# Altium schematic sheet Peripheral.SchDoc
size A4; SheetNumber: 5; SheetTotal: 5
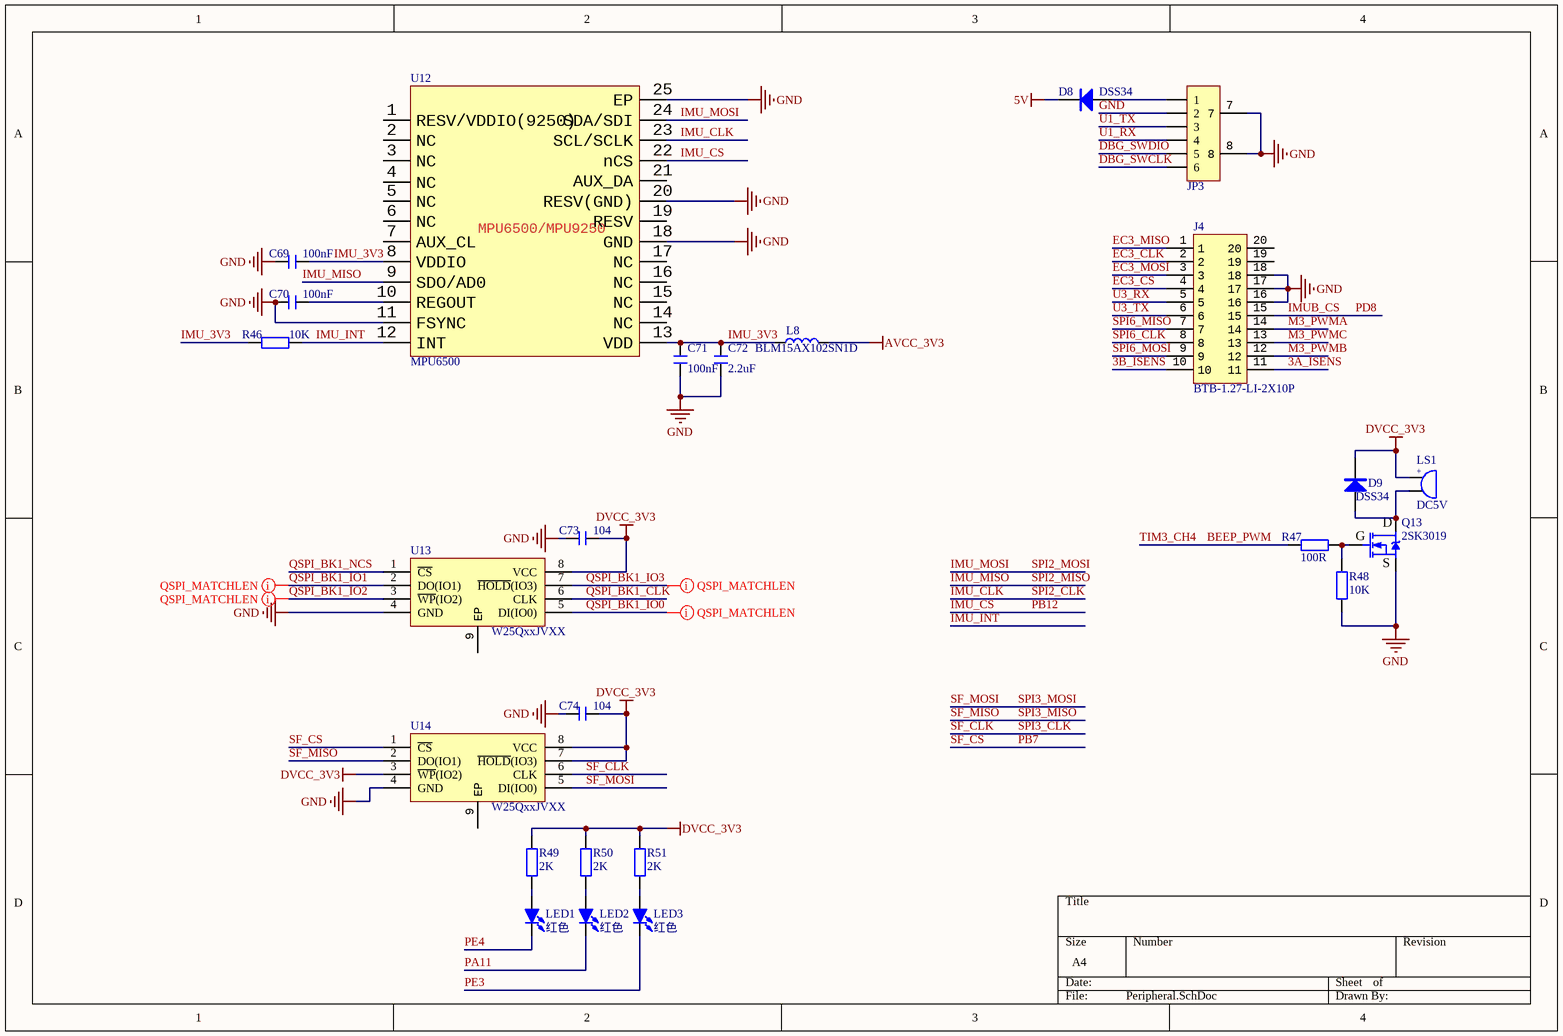
[diagram p0: Peripheral.SchDoc]

## Parts
C69  100nF  [C 0402_L]
C70  100nF  [C 0402_L]
C71  100nF  [C 0402_L]
C72  2.2uF  [C 0402_L]
C73  104  [C 0402_L]
C74  104  [C 0402_L]
D8  DSS34  [SOD-123FL]
D9  DSS34  [SOD-123FL]
J4  BTB-1.27-LI-2X10P  [1.27-LI-2X10P]
JP3  HDR-1X6  [GH1.25-WS-6P]  (value not drawn)
L8  BLM15AX102SN1D  [L 0402]
LED1  红色  [LED 0402R]
LED2  红色  [LED 0402R]
LED3  红色  [LED 0402R]
LS1  DC5V  [BEEP_SMD_SBZ9032C03R16]
Q13  2SK3019  [SOT523]
R46  10K  [R 0402_L]
R47  100R  [R 0402_L]
R48  10K  [R 0402_L]
R49  2K  [R 0402_L]
R50  2K  [R 0402_L]
R51  2K  [R 0402_L]
U12  MPU6500  [QFN24 3X3]
U13  W25QxxJVXX  [SOP8W_L]
U14  W25QxxJVXX  [SOP8W_L]

## Nets
5V: D8.1(K)
AVCC_3V3: L8.2
DVCC_3V3: C73.2 C74.2 D9.1(K) LS1.1 R49.2 R50.2 R51.2 U13.8(VCC) U14.3(~{WP}(IO2)) U14.7(~{HOLD}(IO3)) U14.8(VCC)
GND: C69.2 C70.2 C71.1 C72.1 C73.1 C74.1 J4.16 J4.17 J4.18 JP3.2 JP3.7 JP3.8 Q13.2(S) R48.1 U12.11(FSYNC) U12.18(GND) U12.20(RESV(GND)) U12.25(EP) U13.4(GND) U14.4(GND)
3A_ISENS: J4.11
3B_ISENS: J4.10
BEEP_PWM: R47.1  [also labelled TIM3_CH4]
DBG_SWCLK: JP3.6
DBG_SWDIO: JP3.5
EC3_CLK: J4.2
EC3_CS: J4.4
EC3_MISO: J4.1
EC3_MOSI: J4.3
IMU_3V3: C69.1 C71.2 C72.2 L8.1 R46.1 U12.8(VDDIO) U12.13(VDD)
IMU_CLK: U12.23(SCL/SCLK)  [also labelled SPI2_CLK]
IMU_CS: U12.22(nCS)  [also labelled PB12]
IMU_INT: R46.2 U12.12(INT)
IMU_MISO: U12.9(SDO/AD0)  [also labelled SPI2_MISO]
IMU_MOSI: U12.24(SDA/SDI)  [also labelled SPI2_MOSI]
IMUB_CS: J4.15  [also labelled PD8]
M3_PWMA: J4.14
M3_PWMB: J4.12
M3_PWMC: J4.13
PA11: LED2.1(K)
PB7: U14.1(~{CS})  [also labelled SF_CS]
PE3: LED3.1(K)
PE4: LED1.1(K)
QSPI_BK1_CLK: U13.6(CLK)
QSPI_BK1_IO0: U13.5(DI(IO0))
QSPI_BK1_IO1: U13.2(DO(IO1))
QSPI_BK1_IO2: U13.3(~{WP}(IO2))
QSPI_BK1_IO3: U13.7(~{HOLD}(IO3))
QSPI_BK1_NCS: U13.1(~{CS})
SF_CLK: U14.6(CLK)  [also labelled SPI3_CLK]
SF_MISO: U14.2(DO(IO1))  [also labelled SPI3_MISO]
SF_MOSI: U14.5(DI(IO0))  [also labelled SPI3_MOSI]
SPI6_CLK: J4.8
SPI6_MISO: J4.7
SPI6_MOSI: J4.9
U1_RX: JP3.4
U1_TX: JP3.3
U3_RX: J4.5
U3_TX: J4.6
NetC70_1: C70.1 U12.10(REGOUT)
NetD8_2: D8.2(A) JP3.1
NetD9_2: D9.2(A) LS1.2 Q13.3(D)
NetLED1_2: LED1.2(A) R49.1
NetLED2_2: LED2.2(A) R50.1
NetLED3_2: LED3.2(A) R51.1
NetQ13_1: Q13.1(G) R47.2 R48.2

Not connected (* = marked no-connect by the designer): J4 19 20; U12 1(RESV/VDDIO(9250)) 2(NC) 3(NC) 4(NC) 5(NC) 6(NC) 7(AUX_CL) 14(NC) 15(NC) 16(NC) 17(NC) 19(RESV) 21(AUX_DA); U13 9(EP); U14 9(EP)

## Layout directives
mark named QSPI_MATCHLEN: QSPI_BK1_IO0, QSPI_BK1_IO1, QSPI_BK1_IO2, QSPI_BK1_IO3

## Notes on the sheet
- (in symbol BEEP) +
- (in symbol MPU6500) MPU6500/MPU9250

## Library data of the parts
C69-C74 = C: 无极性贴片电容; 版权归属: 源创客; BOM名称: 无极性贴片电容; 学习资源: www.ooocke.com
D8 D9 = DSS34: 肖特基二极管
J4 = LI-2X10P
JP3 = Header 6: 6P接插件; 版权归属: 源创客; BOM名称: 6P接插件; 学习资源: www.ooocke.com
L8 = L: 小功率贴片电感; 版权归属: 源创客; BOM名称: 小功率贴片电感; 学习资源: www.ooocke.com
LED1-LED3 = LED-SMD: 贴片LED; 版权归属: 源创客; BOM名称: 贴片LED; 学习资源: www.ooocke.com
LS1 = BEEP: 蜂鸣器; 版权归属: 源创客; BOM名称: 蜂鸣器; 学习资源: www.ooocke.com
Q13 = 2SK3019: N沟道场效应管
R46-R51 = R: 贴片电阻; 版权归属: 源创客; BOM名称: 贴片电阻; 学习资源: www.ooocke.com
U12 = MPU6500: 6轴IMU
U13 U14 = W25Qxx: 外置Flash; 版权归属: 源创客; BOM名称: 外置Flash; 学习资源: www.ooocke.com